# EAGLE design pico servo (EAGLE 9.6.2)
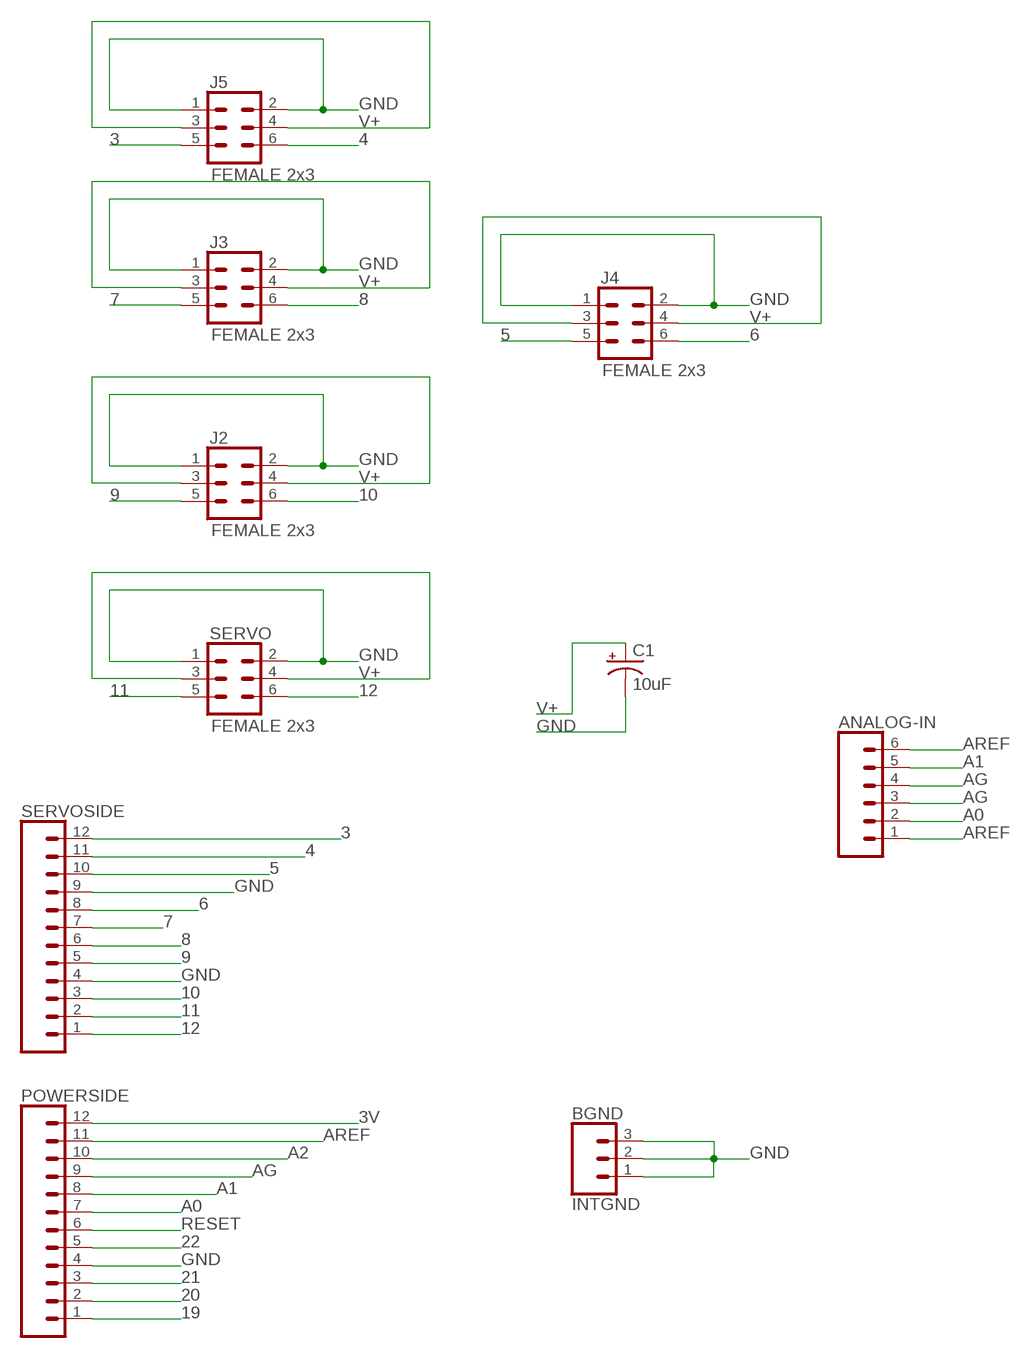
[diagram p0: schematic, sheet 1]

## Parts
ANALOG-IN  CONN_06NO_SILK_FEMALE_PTH  [1X06_NO_SILK]
BGND  INTGND  CONN_03  [1X03]
C1  10uF  10UF-POLAR-RADIAL-2.5MM-25V-20%  [CPOL-RADIAL-2.5MM-5MM]
J2  FEMALE 2x3  CONN_03X2FEMALE  [2X3]
J3  FEMALE 2x3  CONN_03X2FEMALE  [2X3]
J4  FEMALE 2x3  CONN_03X2FEMALE  [2X3]
J5  FEMALE 2x3  CONN_03X2FEMALE  [2X3]
POWERSIDE  CONN_12LONGPADS  [1X12_LONGPADS]
SERVO  FEMALE 2x3  CONN_03X2FEMALE  [2X3]
SERVOSIDE  CONN_12LONGPADS  [1X12_LONGPADS]

## Nets
3: J5.5 SERVOSIDE.12
3V: POWERSIDE.12
4: J5.6 SERVOSIDE.11
5: J4.5 SERVOSIDE.10
6: J4.6 SERVOSIDE.8
7: J3.5 SERVOSIDE.7
8: J3.6 SERVOSIDE.6
9: J2.5 SERVOSIDE.5
10: J2.6 SERVOSIDE.3
11: SERVO.5 SERVOSIDE.2
12: SERVO.6 SERVOSIDE.1
19: POWERSIDE.1
20: POWERSIDE.2
21: POWERSIDE.3
22: POWERSIDE.5
A0: ANALOG-IN.2 POWERSIDE.7
A1: ANALOG-IN.5 POWERSIDE.8
A2: POWERSIDE.10
AG: ANALOG-IN.3 ANALOG-IN.4 POWERSIDE.9
AREF: ANALOG-IN.1 ANALOG-IN.6 POWERSIDE.11
GND: BGND.1 BGND.2 BGND.3 C1.2(-) J2.1 J2.2 J3.1 J3.2 J4.1 J4.2 J5.1 J5.2 POWERSIDE.4 SERVO.1 SERVO.2 SERVOSIDE.4 SERVOSIDE.9
RESET: POWERSIDE.6
V+: C1.1(+) J2.3 J2.4 J3.3 J3.4 J4.3 J4.4 J5.3 J5.4 SERVO.3 SERVO.4

## Library data of the parts
ANALOG-IN = SparkFun-Connectors:CONN_06: Multi connection point. Often used as Generic Header-pin footprint for 0.1 inch spaced/style header connections On any of the 0.1 inch spaced packages, you can populate with these: Break Away Headers - Straight <https://www.sparkfun.com/products/116> (PRT-00116) Break Away Male Headers - Right Angle <https://www.sparkfun.com/products/553> (PRT-00553) Female Headers <https://www.sparkfun.com/products/115> (PRT-00115) Break Away Headers - Machine Pin <https://www.sparkfun.com/products/117> (PRT-00117) Break Away Female Headers - Swiss Machine Pin <https://www.sparkfun.com/products/743> (PRT-00743) Arduino Stackable Header - 6 Pin <https://www.sparkfun.com/products/9280> (PRT-09280) For SCREWTERMINALS and SPRING TERMINALS visit here: Screw Terimnals on SparkFun.com <https://www.sparkfun.com/search/results?term=Screw+Terminals> (5mm/3.5mm/2.54mm spacing) This device is also useful as a general connection point to wire up your design to another part of your project. Our various solder wires solder well into these plated through hole pads. Hook-Up Wire - Assortment (Stranded, 22 AWG) <https://www.sparkfun.com/products/11375> (PRT-11375) Hook-Up Wire - Assortment (Solid Core, 22 AWG) <https://www.sparkfun.com/products/11367> (PRT-11367) View the entire wire category on our website here <https://www.sparkfun.com/categories/141>; PROD_ID: CONN-08437
BGND = SparkFun-Connectors:CONN_03: Multi connection point. Often used as Generic Header-pin footprint for 0.1 inch spaced/style header connections On any of the 0.1 inch spaced packages, you can populate with these: Break Away Headers - Straight <https://www.sparkfun.com/products/116> (PRT-00116) Break Away Male Headers - Right Angle <https://www.sparkfun.com/products/553> (PRT-00553) Female Headers <https://www.sparkfun.com/products/115> (PRT-00115) Break Away Headers - Machine Pin <https://www.sparkfun.com/products/117> (PRT-00117) Break Away Female Headers - Swiss Machine Pin <https://www.sparkfun.com/products/743> (PRT-00743) Stackable Header - 3 Pin (Female, 0.1") <https://www.sparkfun.com/products/13875> (PRT-13875) For SCREWTERMINALS and SPRING TERMINALS visit here: Screw Terimnals on SparkFun.com <https://www.sparkfun.com/search/results?term=Screw+Terminals> (5mm/3.5mm/2.54mm spacing) This device is also useful as a general connection point to wire up your design to another part of your project. Our various solder wires solder well into these plated through hole pads. Hook-Up Wire - Assortment (Stranded, 22 AWG) <https://www.sparkfun.com/products/11375> (PRT-11375) Hook-Up Wire - Assortment (Solid Core, 22 AWG) <https://www.sparkfun.com/products/11367> (PRT-11367) View the entire wire category on our website here <https://www.sparkfun.com/categories/141> Special notes: Molex polarized connector foot print use with SKU : PRT-08232 with associated crimp pins and housings.; PROD_ID: XXX-00000; VALUE: 455-1750-1-ND
C1 = SparkFun-Capacitors:10UF-POLAR: 10.0µF polarized capacitors A capacitor is a passive two-terminal electrical component used to store electrical energy temporarily in an electric field.; PROD_ID: CAP-08440
J2-J5 SERVO = SparkFun-Connectors:CONN_03X2: Multi connection point. Often used as Generic Header-pin footprint for 0.1 inch spaced/style header connections You can populate with any combo of single row headers, but if you'd like an exact match, check these: Header - 2x3 (Male, 0.1") <https://www.sparkfun.com/products/12807> (PRT-12807) Header - 2x3 (Female, 0.1") <https://www.sparkfun.com/products/13010> (PRT-13010) 2x3 Pin Shrouded Header <https://www.sparkfun.com/products/10877> (PRT-10877) On any of the 0.1 inch spaced packages, you can populate with these: Break Away Headers - Straight <https://www.sparkfun.com/products/116> (PRT-00116) Break Away Male Headers - Right Angle <https://www.sparkfun.com/products/553> (PRT-00553) Female Headers <https://www.sparkfun.com/products/115> (PRT-00115) Break Away Headers - Machine Pin <https://www.sparkfun.com/products/117> (PRT-00117) Break Away Female Headers - Swiss Machine Pin <https://www.sparkfun.com/products/743> (PRT-00743) Special note: the shrouded connector mates well with our 3x2 ribbon cables: Ribbon Crimp Connector - 6-pin (2x3, Female) <https://www.sparkfun.com/products/10651> (PRT-10651) Ribbon Cable - 6 wire (15ft) <https://www.sparkfun.com/products/10646> (PRT-10646); PROD_ID: CONN-11566
POWERSIDE SERVOSIDE = SparkFun-Connectors:CONN_12: Multi connection point. Often used as Generic Header-pin footprint for 0.1 inch spaced/style header connections On any of the 0.1 inch spaced packages, you can populate with these: Break Away Headers - Straight <https://www.sparkfun.com/products/116> (PRT-00116) Break Away Male Headers - Right Angle <https://www.sparkfun.com/products/553> (PRT-00553) Female Headers <https://www.sparkfun.com/products/115> (PRT-00115) Break Away Headers - Machine Pin <https://www.sparkfun.com/products/117> (PRT-00117) Break Away Female Headers - Swiss Machine Pin <https://www.sparkfun.com/products/743> (PRT-00743) For SCREWTERMINALS and SPRING TERMINALS visit here: Screw Terimnals on SparkFun.com <https://www.sparkfun.com/search/results?term=Screw+Terminals> (5mm/3.5mm/2.54mm spacing) This device is also useful as a general connection point to wire up your design to another part of your project. Our various solder wires solder well into these plated through hole pads. Hook-Up Wire - Assortment (Stranded, 22 AWG) <https://www.sparkfun.com/products/11375> (PRT-11375) Hook-Up Wire - Assortment (Solid Core, 22 AWG) <https://www.sparkfun.com/products/11367> (PRT-11367) View the entire wire category on our website here <https://www.sparkfun.com/categories/141> Special notes: Molex polarized connector foot print use with SKU : PRT-08231 with associated crimp pins and housings. 1MM SMD Version SKU: PRT-10208 NOTES ON THE VARIANTS LOCK and LOCK_LONGPADS... This footprint was designed to help hold the alignment of a through-hole component (i.e. 6-pin header) while soldering it into place. You may notice that each hole has been shifted either up or down by 0.005 of an inch from it's more standard position (which is a perfectly straight line). This slight alteration caused the pins (the squares in the middle) to touch the edges of the holes. Because they are alternating, it causes a "brace" to hold the component in place. 0.005 has proven to be the perfect amount of "off-center" position when using our standard breakaway headers. Although looks a little odd when you look at the bare footprint, once you have a header in there, the alteration is very hard to notice. Also,if you push a header all the way into place, it is covered up entirely on the bottom side.

## Board
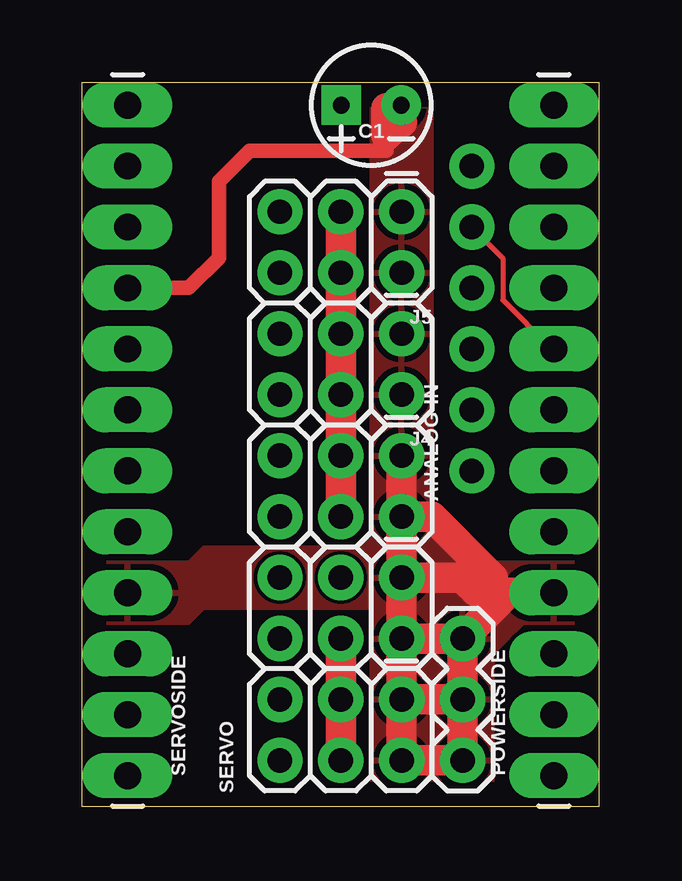
[diagram p1: board, top side]
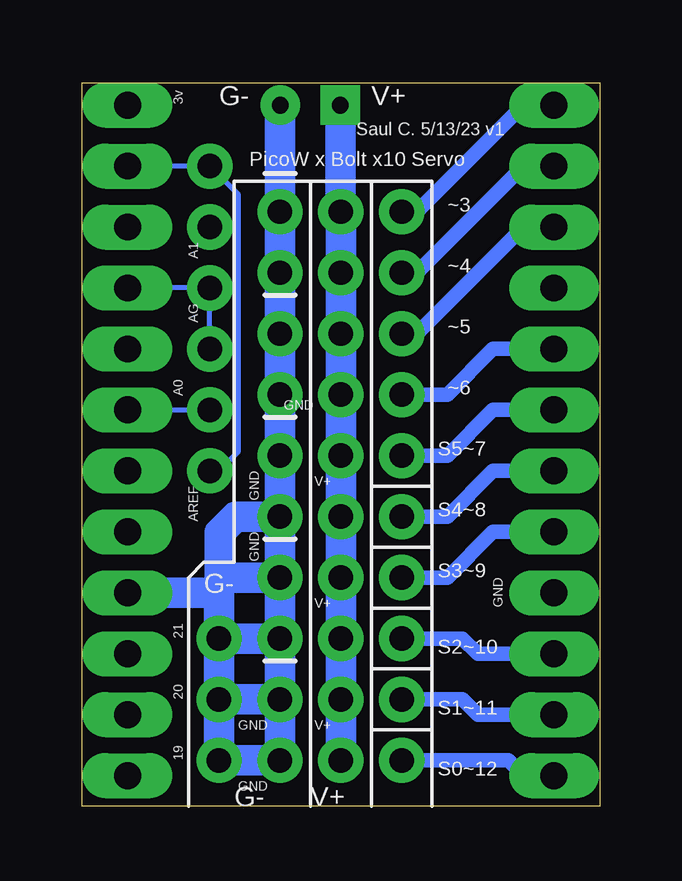
[diagram p2: board, bottom side, seen from below]

Size 21.57 x 30.15 mm. Coordinates in mm from the lower left corner, seen from the top.
Outline: 0,0 21.57,0 21.57,30.15 0,30.15 0,0
Copper layers (1*16): Top 0.035mm / dielectric 1.5mm / Bottom 0.035mm
Design rules "default": minimum track width 6mil, minimum drill 0.35mm, track to track 6mil, track to pad 6mil, pad to pad 6mil, via to via 6mil, smd to smd 6mil, copper to edge 40mil, drill to drill 6mil, minimum pad ring 10mil, minimum via ring 8mil, stop-mask expansion 4mil, vias tented up to drill 0mil, thermal gap 10mil

### Footprints (pad centres in the part's own frame; a part is rotated, then mirrored left to right if it is on the bottom)
1X06_NO_SILK = drill 1.016 pad 1.88: 1 0,0; 2 2.54,0; 3 5.08,0; 4 7.62,0; 5 10.16,0; 6 12.7,0
1X03 = drill 1.016 pad 1.88: 1 0,0; 2 2.54,0; 3 5.08,0
CPOL-RADIAL-2.5MM-5MM = drill 0.7 pad 1.651 square: 1 1.25,0 | drill 0.7 pad 1.651: 2 -1.25,0
2X3 = drill 1.016 pad 1.88: 1 0,0; 2 0,2.54; 3 2.54,0; 4 2.54,2.54; 5 5.08,0; 6 5.08,2.54
1X12_LONGPADS = drill 1.118 pad 1.88 long: 1 0,0; 2 2.54,0; 3 5.08,0; 4 7.62,0; 5 10.16,0; 6 12.7,0; 7 15.24,0; 8 17.78,0; 9 20.32,0; 10 22.86,0; 11 25.4,0; 12 27.94,0

### Placement (x,y rotation side)
ANALOG-IN  16.26,13.97 90 top
BGND  15.88,1.91 90 top
C1  12.06,29.21 180 top
J2  13.34,9.53 180 top
J3  13.34,14.61 180 top
J4  13.34,19.68 180 top
J5  13.34,24.77 180 top
POWERSIDE  19.68,1.27 90 top
SERVO  13.34,4.45 180 top
SERVOSIDE  1.91,1.27 90 top

### Tracks (layer width: path | path; a pad name or v marks a point on that pad's centre or on a via)
3
  Bottom 0.61: J5.5 7.62,24.77 3.56,28.83 1.91,28.83 SERVOSIDE.12
4
  Bottom 0.61: J5.6 7.62,22.23 3.17,26.67 SERVOSIDE.11
5
  Bottom 0.61: SERVOSIDE.10 3.17,24.13 7.62,19.68 J4.5
6
  Bottom 0.61: SERVOSIDE.8 4.45,19.05 6.35,17.14 J4.6
7
  Bottom 0.61: J3.5 6.35,14.61 4.45,16.51 SERVOSIDE.7
8
  Bottom 0.61: J3.6 6.35,12.06 4.45,13.97 SERVOSIDE.6
9
  Bottom 0.61: SERVOSIDE.5 4.45,11.43 6.35,9.53 J2.5
10
  Bottom 0.61: SERVOSIDE.3 5.08,6.35 5.71,6.99 J2.6
11
  Bottom 0.61: SERVO.5 5.71,4.45 5.08,3.81 SERVOSIDE.2
12
  Bottom 0.61: SERVO.6 3.81,1.91 3.17,1.27 SERVOSIDE.1
A0
  Bottom 0.203: POWERSIDE.7 ANALOG-IN.2
A1
  Top 0.203: ANALOG-IN.5 17.55,22.84 17.55,21.1 19.52,19.13 19.61,19.13 POWERSIDE.8
AG
  Bottom 0.203: ANALOG-IN.3 ANALOG-IN.4 POWERSIDE.9
AREF
  Bottom 0.203: ANALOG-IN.1 15.88,13.97 15.06,14.78 15.06,25.48 ANALOG-IN.6 POWERSIDE.11
GND
  Top 0.61: SERVOSIDE.9 4.45,21.59 5.71,22.86 5.71,26.04 6.99,27.3 12.7,27.3
  Top 1.27: BGND.2 BGND.1 SERVO.2 SERVO.1 | SERVO.1 BGND.2 | J2.2 BGND.3 | J2.2 J2.1 | POWERSIDE.4 17.78,8.89 | 17.78,8.89 BGND.3 | 17.78,8.89 16.51,8.89 | 16.51,8.89 15.88,9.53 J2.1 | J3.2 14.61,12.06 17.14,9.53 16.51,8.89 | J3.2 J2.1 | J3.1 J3.2 | J2.2 SERVO.1 | BGND.2 BGND.3 | 13.36,28.5 13.26,28.5 12.7,27.94 12.7,29.08 C1.2
  Bottom 1.27: POWERSIDE.4 16.51,8.89 | J2.1 15.85,9.53 15.85,11.4 15.18,12.06 J3.2 | J3.2 J3.1 J4.2 J4.1 J5.2 J5.1 13.34,29.14 C1.2 | J2.1 J3.2 | J2.2 J2.1 | J2.2 13.34,6.35 | J2.2 SERVO.1 | SERVO.1 SERVO.2 BGND.1 | BGND.1 15.24,1.91 | BGND.1 BGND.2 | BGND.3 BGND.2 | BGND.2 SERVO.1 | BGND.3 J2.2 | BGND.3 15.88,8.89
  pour Top: 4.45,7.62 5.08,8.26 12.06,8.26 12.06,0 17.14,0 17.14,6.35 18.41,7.62 22.23,7.62 22.23,10.16 17.14,10.16 14.61,12.7 14.61,29.84 12.06,32.38 12.06,11.43 11.43,10.79 5.08,10.79 4.45,10.16 -1.91,10.16 -1.91,7.62
V+
  Top 1.27: J3.4 J3.3 J4.4 J4.3 J5.4 J5.3 | J2.4 SERVO.3 SERVO.4
  Bottom 1.27: SERVO.4 SERVO.3 J2.4 J2.3 J3.4 J3.3 J4.4 J4.3 J5.4 J5.3 10.81,24.79 C1.1

### Text on the board
bPlace: 3v | V+ | G- | Saul C. 5/13/23 v1 | PicoW x Bolt x10 Servo | ~3 | A1 | ~4 | AG | ~5 | A0 | ~6 | GND | S5~7 | GND | V+ | AREF | S4~8 | GND | GND | S3~9 | G- | V+ | 21 | S2~10 | 20 | S1~11 | V+ | GND | 19 | S0~12 | GND | V+ | G-